# Altium schematic sheet matrix_corin.schdoc
size 320 x 192 mm
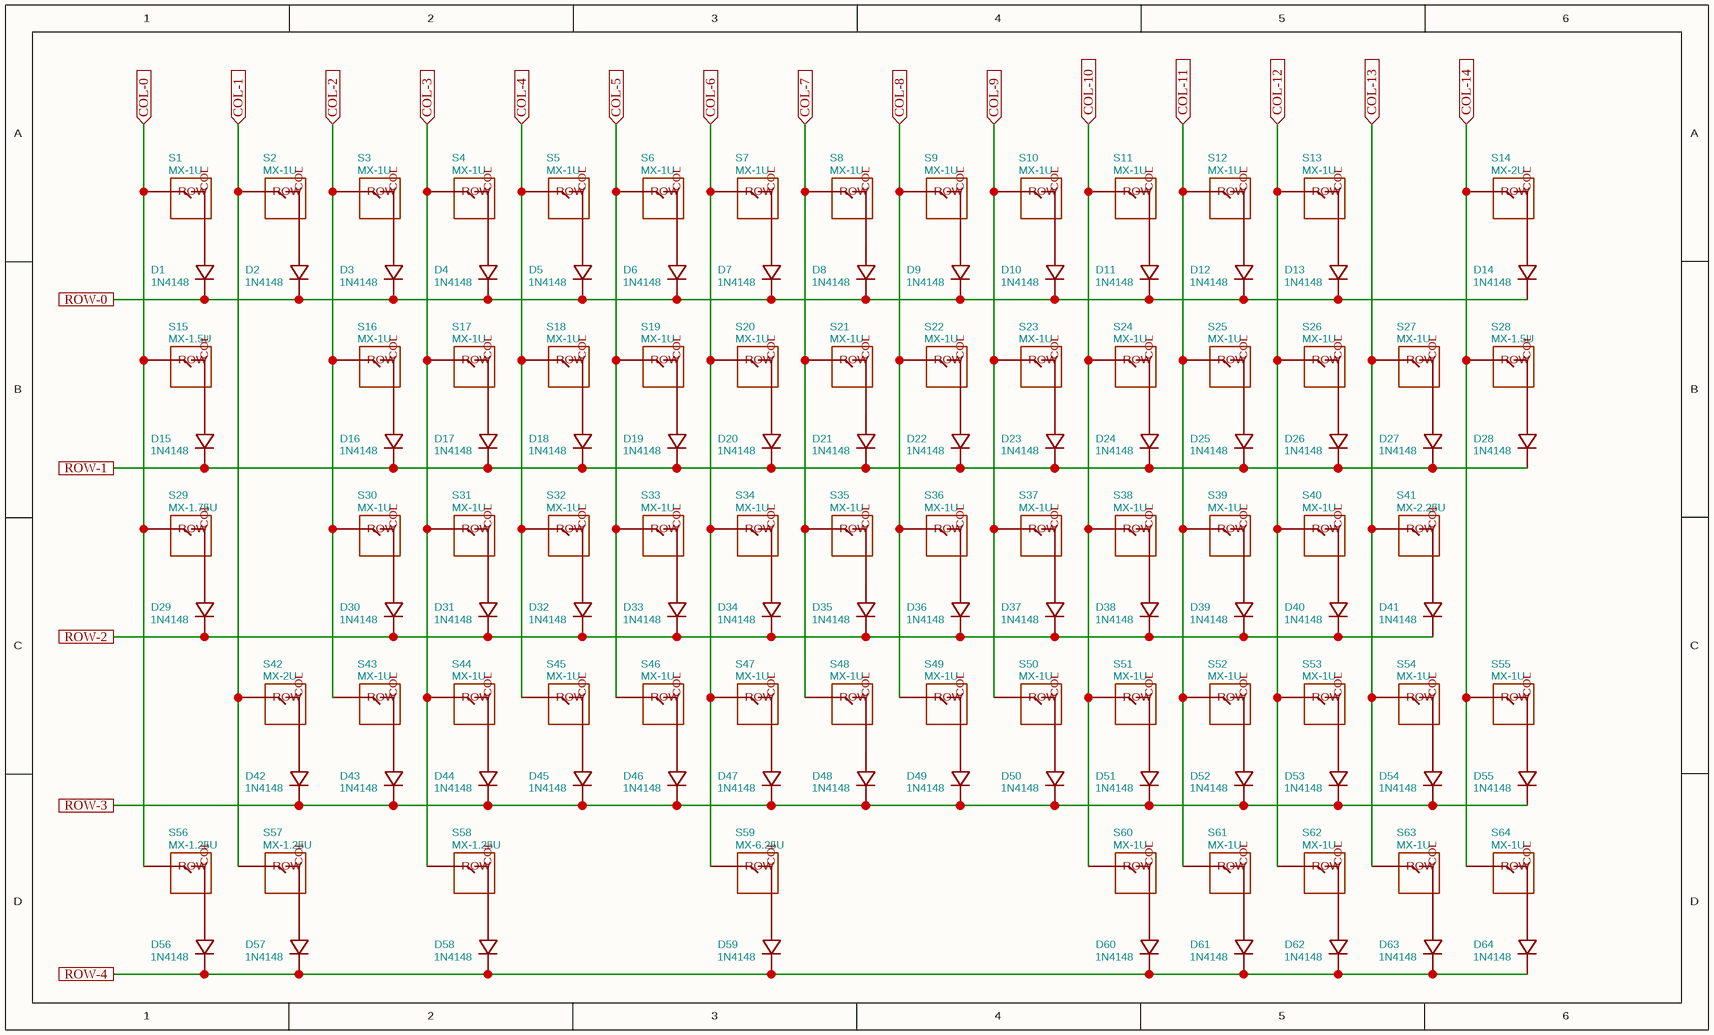
[diagram p0: matrix_corin.schdoc]

## Parts
D1  1N4148  [SOD-123_L2.8-W1.8-LS3.7-RD]
D2  1N4148  [SOD-123_L2.8-W1.8-LS3.7-RD]
D3  1N4148  [SOD-123_L2.8-W1.8-LS3.7-RD]
D4  1N4148  [SOD-123_L2.8-W1.8-LS3.7-RD]
D5  1N4148  [SOD-123_L2.8-W1.8-LS3.7-RD]
D6  1N4148  [SOD-123_L2.8-W1.8-LS3.7-RD]
D7  1N4148  [SOD-123_L2.8-W1.8-LS3.7-RD]
D8  1N4148  [SOD-123_L2.8-W1.8-LS3.7-RD]
D9  1N4148  [SOD-123_L2.8-W1.8-LS3.7-RD]
D10  1N4148  [SOD-123_L2.8-W1.8-LS3.7-RD]
D11  1N4148  [SOD-123_L2.8-W1.8-LS3.7-RD]
D12  1N4148  [SOD-123_L2.8-W1.8-LS3.7-RD]
D13  1N4148  [SOD-123_L2.8-W1.8-LS3.7-RD]
D14  1N4148  [SOD-123_L2.8-W1.8-LS3.7-RD]
D15  1N4148  [SOD-123_L2.8-W1.8-LS3.7-RD]
D16  1N4148  [SOD-123_L2.8-W1.8-LS3.7-RD]
D17  1N4148  [SOD-123_L2.8-W1.8-LS3.7-RD]
D18  1N4148  [SOD-123_L2.8-W1.8-LS3.7-RD]
D19  1N4148  [SOD-123_L2.8-W1.8-LS3.7-RD]
D20  1N4148  [SOD-123_L2.8-W1.8-LS3.7-RD]
D21  1N4148  [SOD-123_L2.8-W1.8-LS3.7-RD]
D22  1N4148  [SOD-123_L2.8-W1.8-LS3.7-RD]
D23  1N4148  [SOD-123_L2.8-W1.8-LS3.7-RD]
D24  1N4148  [SOD-123_L2.8-W1.8-LS3.7-RD]
D25  1N4148  [SOD-123_L2.8-W1.8-LS3.7-RD]
D26  1N4148  [SOD-123_L2.8-W1.8-LS3.7-RD]
D27  1N4148  [SOD-123_L2.8-W1.8-LS3.7-RD]
D28  1N4148  [SOD-123_L2.8-W1.8-LS3.7-RD]
D29  1N4148  [SOD-123_L2.8-W1.8-LS3.7-RD]
D30  1N4148  [SOD-123_L2.8-W1.8-LS3.7-RD]
D31  1N4148  [SOD-123_L2.8-W1.8-LS3.7-RD]
D32  1N4148  [SOD-123_L2.8-W1.8-LS3.7-RD]
D33  1N4148  [SOD-123_L2.8-W1.8-LS3.7-RD]
D34  1N4148  [SOD-123_L2.8-W1.8-LS3.7-RD]
D35  1N4148  [SOD-123_L2.8-W1.8-LS3.7-RD]
D36  1N4148  [SOD-123_L2.8-W1.8-LS3.7-RD]
D37  1N4148  [SOD-123_L2.8-W1.8-LS3.7-RD]
D38  1N4148  [SOD-123_L2.8-W1.8-LS3.7-RD]
D39  1N4148  [SOD-123_L2.8-W1.8-LS3.7-RD]
D40  1N4148  [SOD-123_L2.8-W1.8-LS3.7-RD]
D41  1N4148  [SOD-123_L2.8-W1.8-LS3.7-RD]
D42  1N4148  [SOD-123_L2.8-W1.8-LS3.7-RD]
D43  1N4148  [SOD-123_L2.8-W1.8-LS3.7-RD]
D44  1N4148  [SOD-123_L2.8-W1.8-LS3.7-RD]
D45  1N4148  [SOD-123_L2.8-W1.8-LS3.7-RD]
D46  1N4148  [SOD-123_L2.8-W1.8-LS3.7-RD]
D47  1N4148  [SOD-123_L2.8-W1.8-LS3.7-RD]
D48  1N4148  [SOD-123_L2.8-W1.8-LS3.7-RD]
D49  1N4148  [SOD-123_L2.8-W1.8-LS3.7-RD]
D50  1N4148  [SOD-123_L2.8-W1.8-LS3.7-RD]
D51  1N4148  [SOD-123_L2.8-W1.8-LS3.7-RD]
D52  1N4148  [SOD-123_L2.8-W1.8-LS3.7-RD]
D53  1N4148  [SOD-123_L2.8-W1.8-LS3.7-RD]
D54  1N4148  [SOD-123_L2.8-W1.8-LS3.7-RD]
D55  1N4148  [SOD-123_L2.8-W1.8-LS3.7-RD]
D56  1N4148  [SOD-123_L2.8-W1.8-LS3.7-RD]
D57  1N4148  [SOD-123_L2.8-W1.8-LS3.7-RD]
D58  1N4148  [SOD-123_L2.8-W1.8-LS3.7-RD]
D59  1N4148  [SOD-123_L2.8-W1.8-LS3.7-RD]
D60  1N4148  [SOD-123_L2.8-W1.8-LS3.7-RD]
D61  1N4148  [SOD-123_L2.8-W1.8-LS3.7-RD]
D62  1N4148  [SOD-123_L2.8-W1.8-LS3.7-RD]
D63  1N4148  [SOD-123_L2.8-W1.8-LS3.7-RD]
D64  1N4148  [SOD-123_L2.8-W1.8-LS3.7-RD]
S1  MX-1U  [CHERRY-MX-1U]
S2  MX-1U  [CHERRY-MX-1U]
S3  MX-1U  [CHERRY-MX-1U]
S4  MX-1U  [CHERRY-MX-1U]
S5  MX-1U  [CHERRY-MX-1U]
S6  MX-1U  [CHERRY-MX-1U]
S7  MX-1U  [CHERRY-MX-1U]
S8  MX-1U  [CHERRY-MX-1U]
S9  MX-1U  [CHERRY-MX-1U]
S10  MX-1U  [CHERRY-MX-1U]
S11  MX-1U  [CHERRY-MX-1U]
S12  MX-1U  [CHERRY-MX-1U]
S13  MX-1U  [CHERRY-MX-1U]
S14  MX-2U  [CHERRY-MX-2U]
S15  MX-1.5U  [CHERRY-MX-1.5U]
S16  MX-1U  [CHERRY-MX-1U]
S17  MX-1U  [CHERRY-MX-1U]
S18  MX-1U  [CHERRY-MX-1U]
S19  MX-1U  [CHERRY-MX-1U]
S20  MX-1U  [CHERRY-MX-1U]
S21  MX-1U  [CHERRY-MX-1U]
S22  MX-1U  [CHERRY-MX-1U]
S23  MX-1U  [CHERRY-MX-1U]
S24  MX-1U  [CHERRY-MX-1U]
S25  MX-1U  [CHERRY-MX-1U]
S26  MX-1U  [CHERRY-MX-1U]
S27  MX-1U  [CHERRY-MX-1U]
S28  MX-1.5U  [CHERRY-MX-1.5U]
S29  MX-1.75U  [CHERRY-MX-1.75U]
S30  MX-1U  [CHERRY-MX-1U]
S31  MX-1U  [CHERRY-MX-1U]
S32  MX-1U  [CHERRY-MX-1U]
S33  MX-1U  [CHERRY-MX-1U]
S34  MX-1U  [CHERRY-MX-1U]
S35  MX-1U  [CHERRY-MX-1U]
S36  MX-1U  [CHERRY-MX-1U]
S37  MX-1U  [CHERRY-MX-1U]
S38  MX-1U  [CHERRY-MX-1U]
S39  MX-1U  [CHERRY-MX-1U]
S40  MX-1U  [CHERRY-MX-1U]
S41  MX-2.25U  [CHERRY-MX-2.25U]
S42  MX-2U  [CHERRY-MX-2U]
S43  MX-1U  [CHERRY-MX-1U]
S44  MX-1U  [CHERRY-MX-1U]
S45  MX-1U  [CHERRY-MX-1U]
S46  MX-1U  [CHERRY-MX-1U]
S47  MX-1U  [CHERRY-MX-1U]
S48  MX-1U  [CHERRY-MX-1U]
S49  MX-1U  [CHERRY-MX-1U]
S50  MX-1U  [CHERRY-MX-1U]
S51  MX-1U  [CHERRY-MX-1U]
S52  MX-1U  [CHERRY-MX-1U]
S53  MX-1U  [CHERRY-MX-1U]
S54  MX-1U  [CHERRY-MX-1U]
S55  MX-1U  [CHERRY-MX-1U]
S56  MX-1.25U  [CHERRY-MX-1.25U]
S57  MX-1.25U  [CHERRY-MX-1.25U]
S58  MX-1.25U  [CHERRY-MX-1.25U]
S59  MX-6.25U  [CHERRY-MX-6.25U]
S60  MX-1U  [CHERRY-MX-1U]
S61  MX-1U  [CHERRY-MX-1U]
S62  MX-1U  [CHERRY-MX-1U]
S63  MX-1U  [CHERRY-MX-1U]
S64  MX-1U  [CHERRY-MX-1U]

## Ports
COL-0 (in), COL-1 (in), COL-2 (in), COL-3 (in), COL-4 (in), COL-5 (in), COL-6 (in), COL-7 (in), COL-8 (in), COL-9 (in), COL-10 (in), COL-11 (in), COL-12 (in), COL-13 (in), COL-14 (in), ROW-0 (in), ROW-1 (in), ROW-2 (in), ROW-3 (in), ROW-4 (in)

## Nets
COL-0: S1.ROW S15.ROW S29.ROW S56.ROW ; port COL-0
COL-1: S2.ROW S42.ROW S57.ROW ; port COL-1
COL-2: S3.ROW S16.ROW S30.ROW S43.ROW ; port COL-2
COL-3: S4.ROW S17.ROW S31.ROW S44.ROW S58.ROW ; port COL-3
COL-4: S5.ROW S18.ROW S32.ROW S45.ROW ; port COL-4
COL-5: S6.ROW S19.ROW S33.ROW S46.ROW ; port COL-5
COL-6: S7.ROW S20.ROW S34.ROW S47.ROW S59.ROW ; port COL-6
COL-7: S8.ROW S21.ROW S35.ROW S48.ROW ; port COL-7
COL-8: S9.ROW S22.ROW S36.ROW S49.ROW ; port COL-8
COL-9: S10.ROW S23.ROW S37.ROW S50.ROW ; port COL-9
COL-10: S11.ROW S24.ROW S38.ROW S51.ROW S60.ROW ; port COL-10
COL-11: S12.ROW S25.ROW S39.ROW S52.ROW S61.ROW ; port COL-11
COL-12: S13.ROW S26.ROW S40.ROW S53.ROW S62.ROW ; port COL-12
COL-13: S27.ROW S41.ROW S54.ROW S63.ROW ; port COL-13
COL-14: S14.ROW S28.ROW S55.ROW S64.ROW ; port COL-14
NetD1_1: D1.1(K) D2.1(K) D3.1(K) D4.1(K) D5.1(K) D6.1(K) D7.1(K) D8.1(K) D9.1(K) D10.1(K) D11.1(K) D12.1(K) D13.1(K) D14.1(K)
NetD1_2: D1.2(A) S1.COL
NetD2_2: D2.2(A) S2.COL
NetD3_2: D3.2(A) S3.COL
NetD4_2: D4.2(A) S4.COL
NetD5_2: D5.2(A) S5.COL
NetD6_2: D6.2(A) S6.COL
NetD7_2: D7.2(A) S7.COL
NetD8_2: D8.2(A) S8.COL
NetD9_2: D9.2(A) S9.COL
NetD10_2: D10.2(A) S10.COL
NetD11_2: D11.2(A) S11.COL
NetD12_2: D12.2(A) S12.COL
NetD13_2: D13.2(A) S13.COL
NetD14_2: D14.2(A) S14.COL
NetD15_1: D15.1(K) D16.1(K) D17.1(K) D18.1(K) D19.1(K) D20.1(K) D21.1(K) D22.1(K) D23.1(K) D24.1(K) D25.1(K) D26.1(K) D27.1(K) D28.1(K)
NetD15_2: D15.2(A) S15.COL
NetD16_2: D16.2(A) S16.COL
NetD17_2: D17.2(A) S17.COL
NetD18_2: D18.2(A) S18.COL
NetD19_2: D19.2(A) S19.COL
NetD20_2: D20.2(A) S20.COL
NetD21_2: D21.2(A) S21.COL
NetD22_2: D22.2(A) S22.COL
NetD23_2: D23.2(A) S23.COL
NetD24_2: D24.2(A) S24.COL
NetD25_2: D25.2(A) S25.COL
NetD26_2: D26.2(A) S26.COL
NetD27_2: D27.2(A) S27.COL
NetD28_2: D28.2(A) S28.COL
NetD29_1: D29.1(K) D30.1(K) D31.1(K) D32.1(K) D33.1(K) D34.1(K) D35.1(K) D36.1(K) D37.1(K) D38.1(K) D39.1(K) D40.1(K) D41.1(K)
NetD29_2: D29.2(A) S29.COL
NetD30_2: D30.2(A) S30.COL
NetD31_2: D31.2(A) S31.COL
NetD32_2: D32.2(A) S32.COL
NetD33_2: D33.2(A) S33.COL
NetD34_2: D34.2(A) S34.COL
NetD35_2: D35.2(A) S35.COL
NetD36_2: D36.2(A) S36.COL
NetD37_2: D37.2(A) S37.COL
NetD38_2: D38.2(A) S38.COL
NetD39_2: D39.2(A) S39.COL
NetD40_2: D40.2(A) S40.COL
NetD41_2: D41.2(A) S41.COL
NetD42_1: D42.1(K) D43.1(K) D44.1(K) D45.1(K) D46.1(K) D47.1(K) D48.1(K) D49.1(K) D50.1(K) D51.1(K) D52.1(K) D53.1(K) D54.1(K) D55.1(K)
NetD42_2: D42.2(A) S42.COL
NetD43_2: D43.2(A) S43.COL
NetD44_2: D44.2(A) S44.COL
NetD45_2: D45.2(A) S45.COL
NetD46_2: D46.2(A) S46.COL
NetD47_2: D47.2(A) S47.COL
NetD48_2: D48.2(A) S48.COL
NetD49_2: D49.2(A) S49.COL
NetD50_2: D50.2(A) S50.COL
NetD51_2: D51.2(A) S51.COL
NetD52_2: D52.2(A) S52.COL
NetD53_2: D53.2(A) S53.COL
NetD54_2: D54.2(A) S54.COL
NetD55_2: D55.2(A) S55.COL
NetD56_1: D56.1(K) D57.1(K) D58.1(K) D59.1(K) D60.1(K) D61.1(K) D62.1(K) D63.1(K) D64.1(K)
NetD56_2: D56.2(A) S56.COL
NetD57_2: D57.2(A) S57.COL
NetD58_2: D58.2(A) S58.COL
NetD59_2: D59.2(A) S59.COL
NetD60_2: D60.2(A) S60.COL
NetD61_2: D61.2(A) S61.COL
NetD62_2: D62.2(A) S62.COL
NetD63_2: D63.2(A) S63.COL
NetD64_2: D64.2(A) S64.COL

## Library data of the parts
D1-D64 = 1N4148: BOM_Manufacturer: Jingdao; BOM_Manufacturer Part: 1N4148W; BOM_Supplier: LCSC; BOM_Supplier Part: C115103; spicePre: D; spiceSymbolName: 1N4148W_C115103
S1-S13 S16-S27 S30-S40 S43-S55 S60-S64 = MX-1U: BOM_Manufacturer Part: Cherry MX; Contributor: Longnald; BOM_Supplier: Longnald; spicePre: S; spiceSymbolName: MX-1U
S14 S42 = MX-2U: BOM_Manufacturer Part: CherryMX; Contributor: Longnald; BOM_Supplier: Longnald; spicePre: S; spiceSymbolName: MX-2U
S15 S28 = MX-1.5U: BOM_Manufacturer Part: Cherry MX; Contributor: Longnald; BOM_Supplier: Longnald; spicePre: S; spiceSymbolName: MX-1.5U
S29 = MX-1.75U: BOM_Manufacturer Part: CherryMX; Contributor: Longnald; BOM_Supplier: Longnald; spicePre: S; spiceSymbolName: MX-1.75U
S41 = MX-2.25U: BOM_Manufacturer Part: CherryMX; Contributor: Longnald; BOM_Supplier: Longnald; spicePre: S; spiceSymbolName: MX-2.25U
S56-S58 = MX-1.25U: BOM_Manufacturer Part: CherryMX; Contributor: Longnald; BOM_Supplier: Longnald; spicePre: S; spiceSymbolName: MX-1.25U
S59 = MX-6.25U: BOM_Manufacturer Part: CherryMX; Contributor: Longnald; BOM_Supplier: Longnald; spicePre: S; spiceSymbolName: MX-6.25U